# Altium schematic sheet FAST.SchDoc
size A3; CompanyName: HESSO; Address1: Route du Rawyl 47; Address2: 1950 Sion; Address3: Switzerland; SheetNumber: 1; SheetTotal: 4; PageSetup: Record=PageOptions|CenterHorizontal=True|CenterVertical=True|PrintScale=1.00|XCorrection=1.00|YCorrection=1.00|PrintKind=1|BorderSize=5000000|LeftOffset=0|BottomOffset=0|Orientation=2|PaperLength=1000|PaperWidth=1000|Scale=100|PaperSource=15|PrintQuality=1200|MediaType=1|DitherType=10|PrintScaleMode=1|PaperKind=A4|PaperIndex=9; ProjectName: Project Name
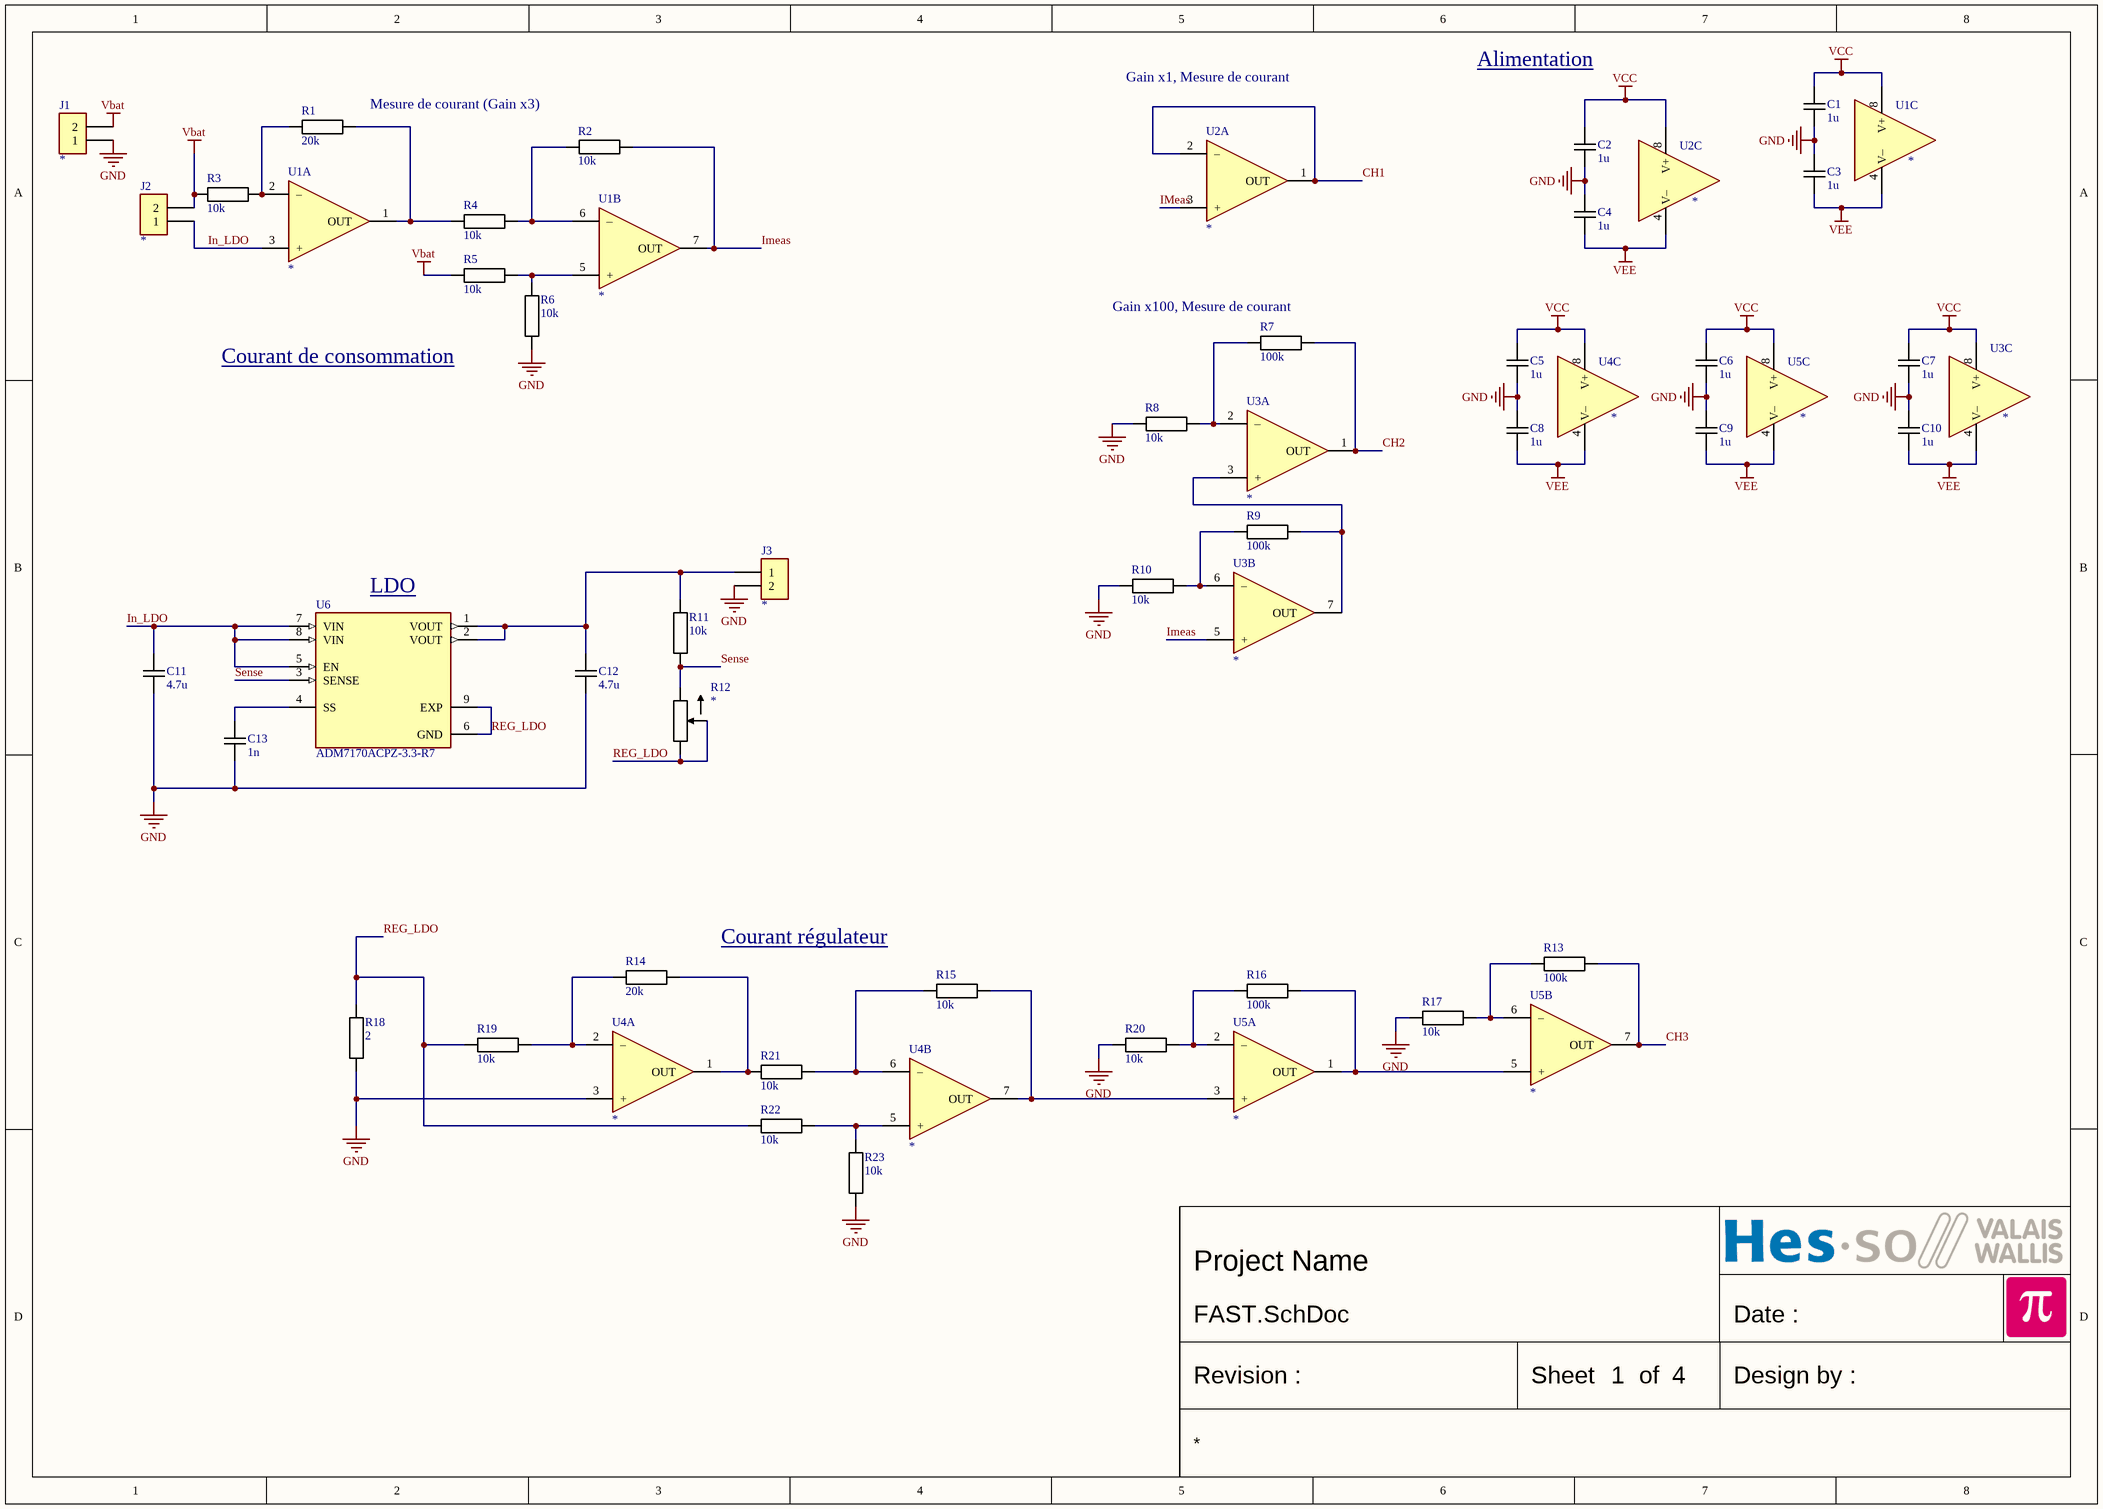
[diagram p0: FAST.SchDoc]

## Parts
C1  1u  [CAPACITOR 1005 REFLOW]
C2  1u  [CAPACITOR 1005 REFLOW]
C3  1u  [CAPACITOR 1005 REFLOW]
C4  1u  [CAPACITOR 1005 REFLOW]
C5  1u  [CAPACITOR 1005 REFLOW]
C6  1u  [CAPACITOR 1005 REFLOW]
C7  1u  [CAPACITOR 1005 REFLOW]
C8  1u  [CAPACITOR 1005 REFLOW]
C9  1u  [CAPACITOR 1005 REFLOW]
C10  1u  [CAPACITOR 1005 REFLOW]
C11  4.7u  [CAPACITOR 1005 REFLOW]
C12  4.7u  [CAPACITOR 1005 REFLOW]
C13  1n  [CAPACITOR 1005 REFLOW]
J1  *  [WE 691312510002]
J2  *  [WE 691312510002]
J3  *  [WE 691312510002]
R1  20k  [RESISTOR 1005 REFLOW]
R2  10k  [RESISTOR 1005 REFLOW]
R3  10k  [RESISTOR 1005 REFLOW]
R4  10k  [RESISTOR 1005 REFLOW]
R5  10k  [RESISTOR 1005 REFLOW]
R6  10k  [RESISTOR 1005 REFLOW]
R7  100k  [RESISTOR 1005 REFLOW]
R8  10k  [RESISTOR 1005 REFLOW]
R9  100k  [RESISTOR 1005 REFLOW]
R10  10k  [RESISTOR 1005 REFLOW]
R11  10k  [RESISTOR 1005 REFLOW]
R12  *  [Trimmer PIHER PT15]
R13  100k  [RESISTOR 1005 REFLOW]
R14  20k  [RESISTOR 1005 REFLOW]
R15  10k  [RESISTOR 1005 REFLOW]
R16  100k  [RESISTOR 1005 REFLOW]
R17  10k  [RESISTOR 1005 REFLOW]
R18  2  [RESISTOR 1005 REFLOW]
R19  10k  [RESISTOR 1005 REFLOW]
R20  10k  [RESISTOR 1005 REFLOW]
R21  10k  [RESISTOR 1005 REFLOW]
R22  10k  [RESISTOR 1005 REFLOW]
R23  10k  [RESISTOR 1005 REFLOW]
U1  *  [SO8 P1.27 C4.0X5.0 H1.75]  (parts A,B,C of 3)
U2  *  [SO8 P1.27 C4.0X5.0 H1.75]  (parts A,C of 3)
U3  *  [SO8 P1.27 C4.0X5.0 H1.75]  (parts A,B,C of 3)
U4  *  [SO8 P1.27 C4.0X5.0 H1.75]  (parts A,B,C of 3)
U5  *  [SO8 P1.27 C4.0X5.0 H1.75]  (parts A,B,C of 3)
U6  ADM7170ACPZ-3.3-R7  [LFCSP8 P0.5 C3.0x2.8 H1.0]

## Nets
GND: C1.2 C2.2 C3.1 C4.1 C5.2 C6.2 C7.2 C8.1 C9.1 C10.1 C11.2 C12.2 C13.2 J1.1 J3.2 R6.1 R8.1 R10.1 R17.2 R18.1 R20.2 R23.2 U4.3(+)
Vbat: J1.2 J2.2 R3.1 R5.1
VCC: C1.1 C2.1 C5.1 C6.1 C7.1 U1.8(V+) U2.8(V+) U3.8(V+) U4.8(V+) U5.8(V+)
VEE: C3.2 C4.2 C8.2 C9.2 C10.2 U1.4(V–) U2.4(V–) U3.4(V–) U4.4(V–) U5.4(V–)
CH1: U2.1(OUT) U2.2(–)
CH2: R7.2 U3.1(OUT)
CH3: R13.1 U5.7(OUT)
IMeas: R2.2 U1.7(OUT) U2.3(+) U3.5(+)
In_LDO: C11.1 J2.1 U1.3(+) U6.5(EN) U6.7(VIN) U6.8(VIN)
REG_LDO: R12.1 R12.2(WIPER) R18.2 R19.2 R22.2 U6.6(GND) U6.9(EXP)
Sense: R11.1 R12.3 U6.3(SENSE)
NetC12_1: C12.1 J3.1 R11.2 U6.1(VOUT) U6.2(VOUT)
NetC13_1: C13.1 U6.4(SS)
NetR1_1: R1.1 R3.2 U1.2(–)
NetR1_2: R1.2 R4.1 U1.1(OUT)
NetR2_1: R2.1 R4.2 U1.6(–)
NetR5_2: R5.2 R6.2 U1.5(+)
NetR7_1: R7.1 R8.2 U3.2(–)
NetR9_1: R9.1 R10.2 U3.6(–)
NetR9_2: R9.2 U3.3(+) U3.7(OUT)
NetR13_2: R13.2 R17.1 U5.6(–)
NetR14_1: R14.1 R21.2 U4.1(OUT)
NetR14_2: R14.2 R19.1 U4.2(–)
NetR15_1: R15.1 U4.7(OUT) U5.3(+)
NetR15_2: R15.2 R21.1 U4.6(–)
NetR16_1: R16.1 U5.1(OUT) U5.5(+)
NetR16_2: R16.2 R20.1 U5.2(–)
NetR22_1: R22.1 R23.1 U4.5(+)

## Notes on the sheet
- Mesure de courant (Gain x3)
- Gain x1, Mesure de courant
- Alimentation
- (near R7) Gain x100, Mesure de courant
- Courant de consommation
- (near U6) LDO
- Courant régulateur
- Date :
- Revision :
- Sheet
- of
- Design by :

## Library data of the parts
C1-C13 = Capacitor
  C1-C10: Value: 1u
  C11 C12: Value: 4.7u
  C13: Value: 1n
J1-J3 = Header2: PCB terminal block; Value: *
R1-R11 R13-R23 = Resistor
  R1 R14: Value: 20k
  R2-R6 R8 R10 R11 R15 R17 R19-R23: Value: 10k
  R7 R9 R13 R16: Value: 100k
  R18: Value: 2
R12 = Trimmer: Value: *
U1-U5 = OPA DUAL: Generic dual OPA 8 pins; Value: *
U6 = ADM7170ACPZ-3.3-R7: 6.5 V, 500 mA, Ultralow Noise, High PSRR, Fast Transient Response CMOS LDO; MF: Analog Devices; SnapEDA_Link: https://www.snapeda.com/parts/ADM7170ACPZ-3.3-R7/Analog+Devices/view-part/?ref=snap; Package: LFCSP -8 Analog Devices; Value: *; MP: ADM7170ACPZ-3.3-R7; Check_prices: https://www.snapeda.com/parts/ADM7170ACPZ-3.3-R7/Analog+Devices/view-part/?ref=eda